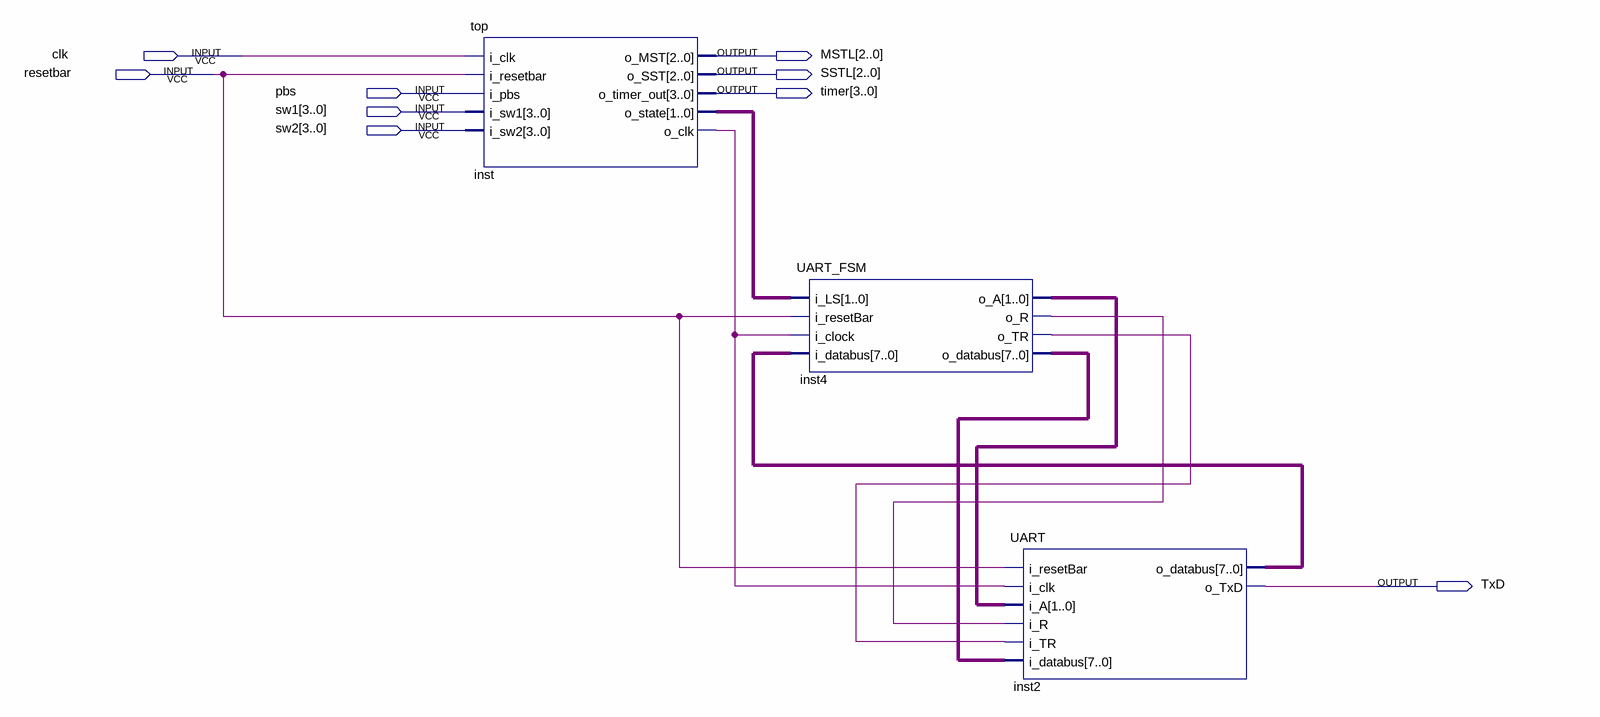
[diagram p0: schematic sheet]
// Quartus schematic lab3.bdf as structural Verilog: 3 symbols, 9 pins
module lab3 (
  input  clk,
  input  resetbar,
  input  pbs,
  input  [3:0] sw1,
  input  [3:0] sw2,
  output [2:0] MSTL,
  output [2:0] SSTL,
  output [3:0] timer,
  output TxD
);

  wire inst4_o_r, inst4_o_tr, inst_o_clk;
  wire [1:0] inst4_o_a, inst_o_state;
  wire [7:0] inst2_o_databus, inst4_o_databus;

  top inst (
    .i_clk(clk), .i_resetbar(resetbar), .i_pbs(pbs), .i_sw1(sw1), .i_sw2(sw2), .o_MST(MSTL), .o_SST(SSTL),
    .o_timer_out(timer), .o_state(inst_o_state), .o_clk(inst_o_clk));
  UART_FSM inst4 (
    .i_LS(inst_o_state), .i_resetBar(resetbar), .i_clock(inst_o_clk), .i_databus(inst2_o_databus),
    .o_A(inst4_o_a), .o_R(inst4_o_r), .o_TR(inst4_o_tr), .o_databus(inst4_o_databus));
  UART inst2 (
    .i_resetBar(resetbar), .i_clk(inst_o_clk), .i_A(inst4_o_a), .i_R(inst4_o_r), .i_TR(inst4_o_tr),
    .i_databus(inst4_o_databus), .o_databus(inst2_o_databus), .o_TxD(TxD));
endmodule
